# Altium schematic sheet Analog Sensors.SchDoc
size A; SheetNumber: 2; SheetTotal: 5
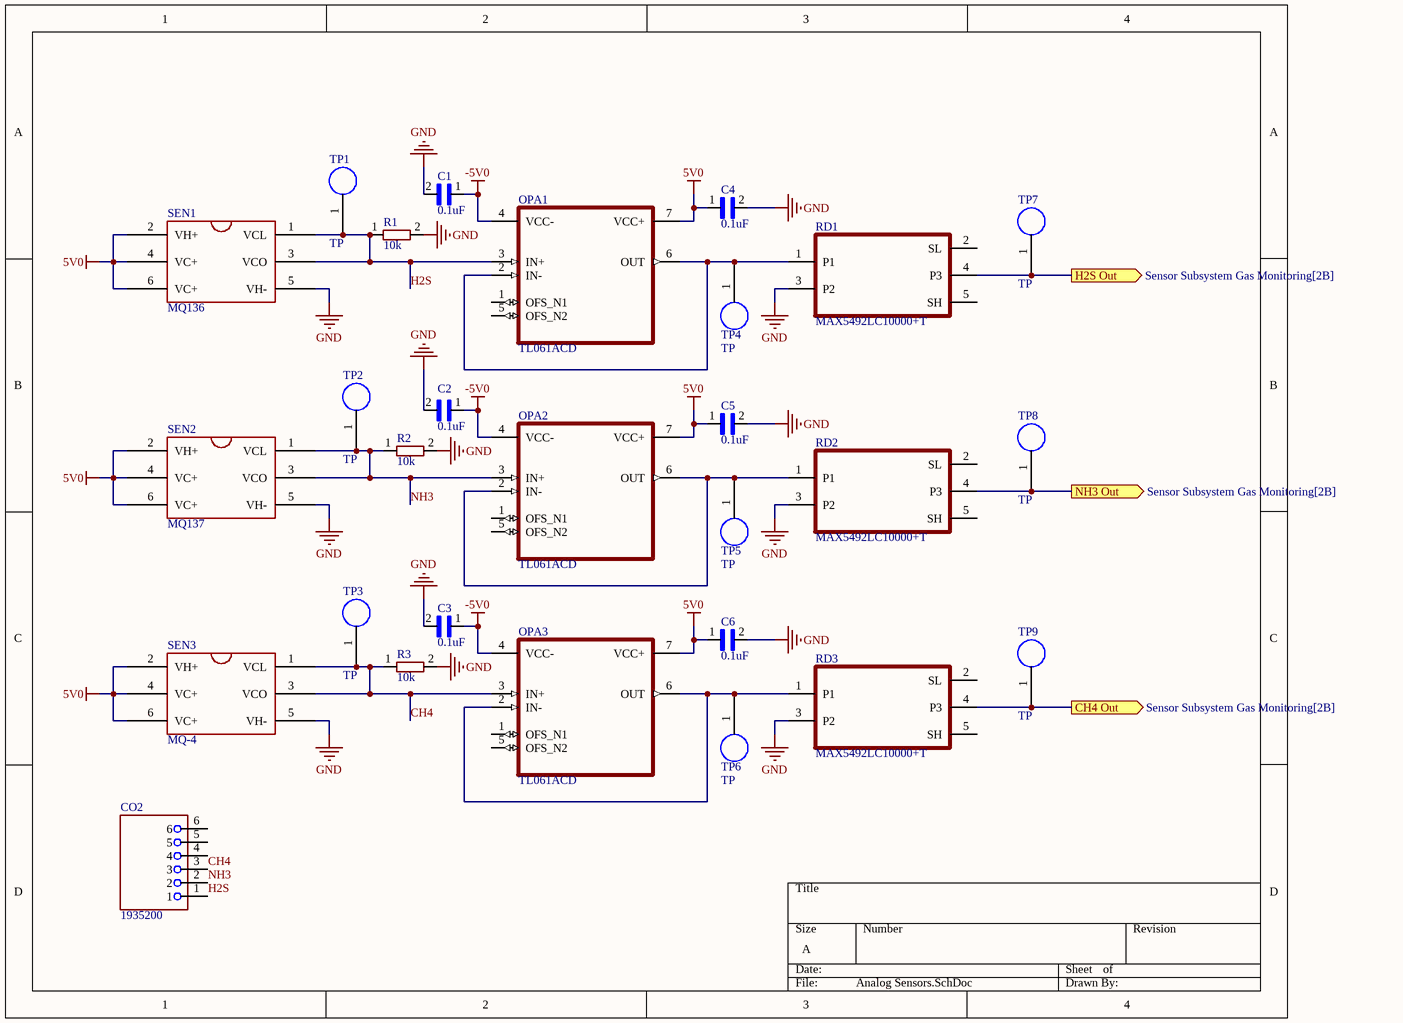
[diagram p0: Analog Sensors.SchDoc]

## Parts
C1  0.1uF  [0.1uF Capacitor]
C2  0.1uF  [0.1uF Capacitor]
C3  0.1uF  [0.1uF Capacitor]
C4  0.1uF  [0.1uF Capacitor]
C5  0.1uF  [0.1uF Capacitor]
C6  0.1uF  [0.1uF Capacitor]
CO2  1935200  [PHOENIX_1935200]
OPA1  TL061ACD  [SOIC127P599X175-8N]
OPA2  TL061ACD  [SOIC127P599X175-8N]
OPA3  TL061ACD  [SOIC127P599X175-8N]
R1  10k  [0603]
R2  10k  [0603]
R3  10k  [0603]
RD1  MAX5492LC10000+T  [SOT95P280X145-5N]
RD2  MAX5492LC10000+T  [SOT95P280X145-5N]
RD3  MAX5492LC10000+T  [SOT95P280X145-5N]
SEN1  MQ136  [MQ136]
SEN2  MQ137  [MQ137]
SEN3  MQ-4  [MQ4]
TP1  TP  [TestPoint]  (no BOM)
TP2  TP  [TestPoint]  (no BOM)
TP3  TP  [TestPoint]  (no BOM)
TP4  TP  [TestPoint]  (no BOM)
TP5  TP  [TestPoint]  (no BOM)
TP6  TP  [TestPoint]  (no BOM)
TP7  TP  [TestPoint]  (no BOM)
TP8  TP  [TestPoint]  (no BOM)
TP9  TP  [TestPoint]  (no BOM)

## Ports
CH4 Out (out, see Sensor Subsystem Gas Monitoring[2B]), H2S Out (out, see Sensor Subsystem Gas Monitoring[2B]), NH3 Out (out, see Sensor Subsystem Gas Monitoring[2B])

## Nets
5V0: C4.1 C5.1 C6.1 OPA1.7(VCC+) OPA2.7(VCC+) OPA3.7(VCC+) SEN1.2(VH+) SEN1.4(VC+) SEN1.6(VC+) SEN2.2(VH+) SEN2.4(VC+) SEN2.6(VC+) SEN3.2(VH+) SEN3.4(VC+) SEN3.6(VC+)
-5V0: C1.1 C2.1 C3.1 OPA1.4(VCC-) OPA2.4(VCC-) OPA3.4(VCC-)
GND: C1.2 C2.2 C3.2 C4.2 C5.2 C6.2 R1.2 R2.2 R3.2 RD1.3(P2) RD2.3(P2) RD3.3(P2) SEN1.5(VH-) SEN2.5(VH-) SEN3.5(VH-)
CH4: CO2.3 OPA3.3(IN+) R3.1 SEN3.1(VCL) SEN3.3(VCO) TP3.1
CH4 Out: RD3.4(P3) TP9.1 ; port CH4 Out
H2S: CO2.1 OPA1.3(IN+) R1.1 SEN1.1(VCL) SEN1.3(VCO) TP1.1
H2S Out: RD1.4(P3) TP7.1 ; port H2S Out
NH3: CO2.2 OPA2.3(IN+) R2.1 SEN2.1(VCL) SEN2.3(VCO) TP2.1
NH3 Out: RD2.4(P3) TP8.1 ; port NH3 Out
NetOPA1_2: OPA1.2(IN-) OPA1.6(OUT) RD1.1(P1) TP4.1
NetOPA2_2: OPA2.2(IN-) OPA2.6(OUT) RD2.1(P1) TP5.1
NetOPA3_2: OPA3.2(IN-) OPA3.6(OUT) RD3.1(P1) TP6.1

Not connected (* = marked no-connect by the designer): CO2 4 5 6; OPA1 1(OFS_N1) 5(OFS_N2); OPA2 1(OFS_N1) 5(OFS_N2); OPA3 1(OFS_N1) 5(OFS_N2); RD1 2(SL) 5(SH); RD2 2(SL) 5(SH); RD3 2(SL) 5(SH)

## Library data of the parts
C1-C6 = CC1206JRX7R9BB104: No Description Available; Mfr_Name: Yageo
CO2 = 1935200: PCB terminal block - nominal current: 17.5 A - rated voltage (III/2): 400 V - nominal cross section: 1.5 mm² - pitch: 5 mm - number of positions: 6 - connection method: Screw connection with wire protector - mounting: Wave soldering - conductor/PCB connection direction: 0 ° - color: green - Pin layout: Linear pinning - Solder pin [P]: 3.5 mm; MF: Littelfuse; SnapEDA_Link: https://www.snapeda.com/parts/1935200/Littelfuse/view-part/?ref=snap; Package: None; Value: *; MP: 1935200; Check_prices: https://www.snapeda.com/parts/1935200/Littelfuse/view-part/?ref=eda
R1-R3 = RC0603FR-1310KL: http://octopart.com/rc0603fr-1310kl-yageo+%2F+phycomp-25905087; Package: None; Price: None; Value: *; MP: RC0603FR-1310KL; Availability: Unavailable
RD1-RD3 = MAX5492LC10000+T: Res NET 9.09K Ohm/910 Ohm 0.1% 0.5714W Â±35ppm/Â°C VOLT/D 5-Pin SOT-23 Gull Wing SMD T/R; MF: Maxim Integrated Products; SnapEDA_Link: https://www.snapeda.com/parts/MAX5492LC10000+T/Maxim+Integrated/view-part/?ref=snap; Package: None; Value: *; MP: MAX5492LC10000+T; Check_prices: https://www.snapeda.com/parts/MAX5492LC10000+T/Maxim+Integrated/view-part/?ref=eda
SEN1 = MQ136: Hydrogen Sulfide Sensor
SEN2 = MQ137: Ammonia Sensor
SEN3 = MQ-4: Methane Sensor
TP1-TP9 = TestPoint: Test point for voltage, current, ect.
OPA1-OPA3 = TL061ACD: Package: None; Price: None; Value: *; MP: TL061ACD; Availability: Unavailable